# Altium schematic sheet I2C.SchDoc
size A4
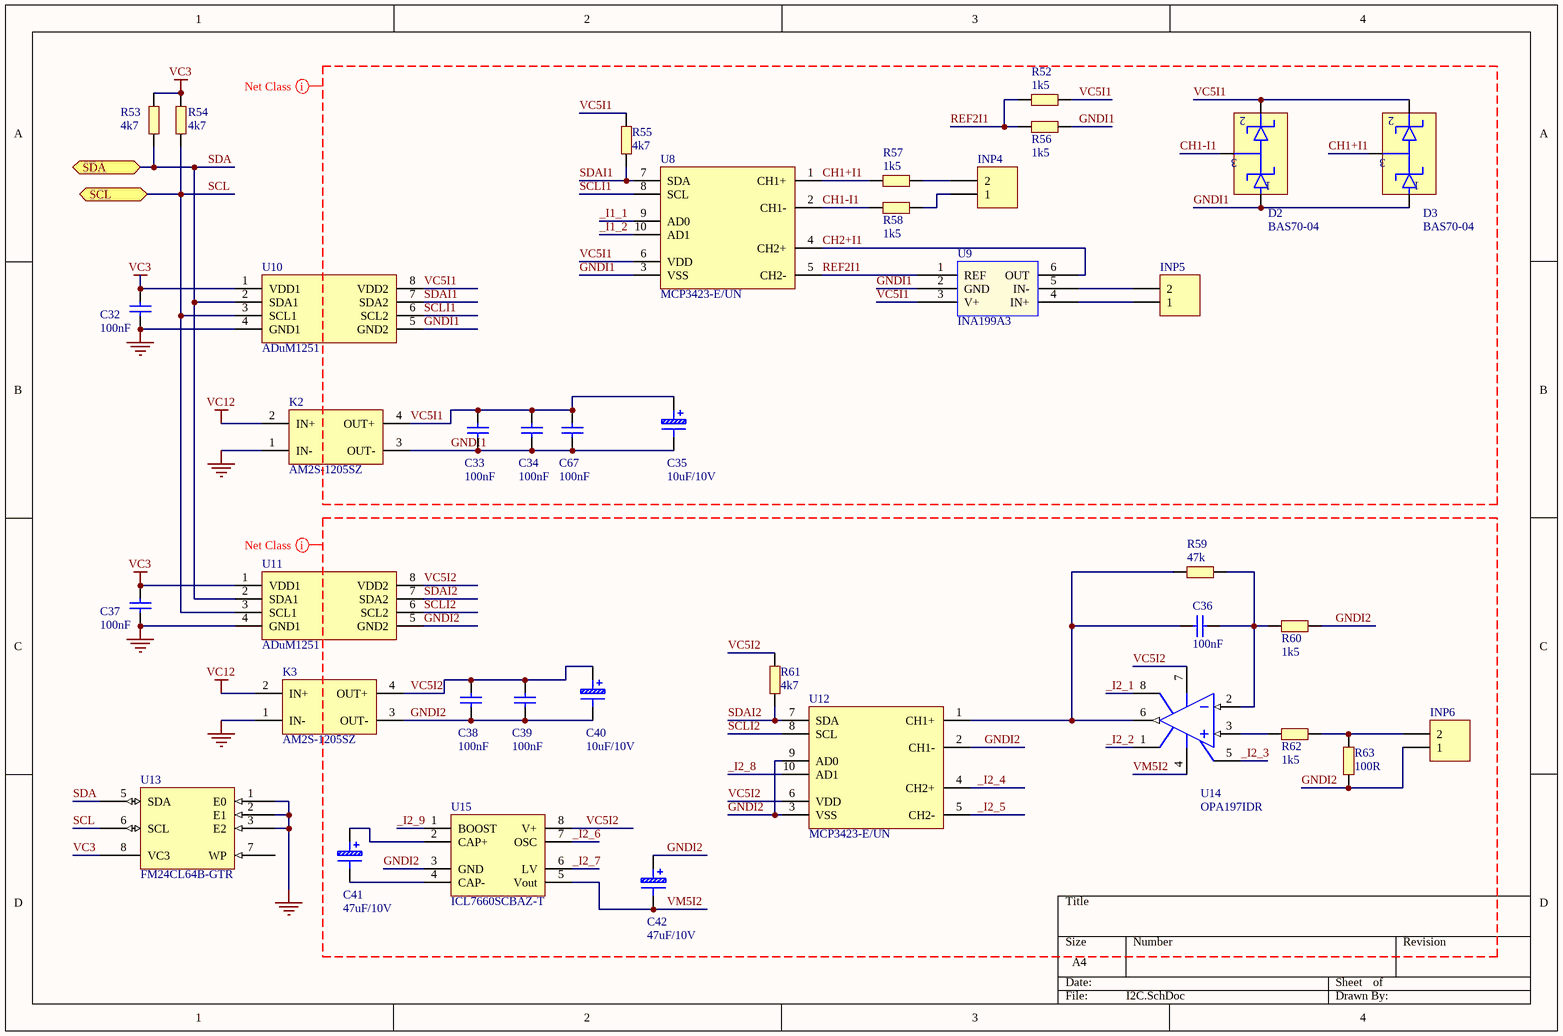
[diagram p0: I2C.SchDoc]

## Parts
C32  100nF  [0603C]
C33  100nF  [0603C]
C34  100nF  [0603C]
C35  10uF/10V  [CAP_A]
C36  100nF  [0603C]
C37  100nF  [0603C]
C38  100nF  [0603C]
C39  100nF  [0603C]
C40  10uF/10V  [CAP_A]
C41  47uF/10V  [CAP_C]
C42  47uF/10V  [CAP_C]
C67  100nF  [0603C]
D2  BAS70-04  [SOT-23]
D3  BAS70-04  [SOT-23]
INP4  Header 2  [JST-XH-2Y-2.54]  (value not drawn)
INP5  Header 2  [JST-XH-2Y-2.54]  (value not drawn)
INP6  Header 2  [JST-XH-2Y-2.54]  (value not drawn)
K2  AM2S-1205SZ  [DCDC_SIL4]
K3  AM2S-1205SZ  [DCDC_SIL4]
R52  1k5  [0603R]
R53  4k7  [0603R]
R54  4k7  [0603R]
R55  4k7  [0603R]
R56  1k5  [0603R]
R57  1k5  [0603R]
R58  1k5  [0603R]
R59  47k  [0603R]
R60  1k5  [0603R]
R61  4k7  [0603R]
R62  1k5  [0603R]
R63  100R  [0603R]
U8  MCP3423-E/UN  [MSOP10_1]
U9  INA199A3  [SC70-6]
U10  ADuM1251  [SO8]
U11  ADuM1251  [SO8]
U12  MCP3423-E/UN  [MSOP10_1]
U13  FM24CL64B-GTR  [SO8]
U14  OPA197IDR  [SO8]
U15  ICL7660SCBAZ-T  [SO8]

## Ports
SCL (bidir), SDA (bidir)

## Nets
GND: C32.1 C37.1 K2.1(IN-) K3.1(IN-) U10.4(GND1) U11.4(GND1) U13.1(E0) U13.2(E1) U13.3(E2) U13.4(GND)
VC3: C32.2 C37.2 R53.1 R54.1 U10.1(VDD1) U11.1(VDD1) U13.8(VC3)
VC12: K2.2(IN+) K3.2(IN+)
_I1_1: U8.9(AD0)
_I1_2: U8.10(AD1)
_I2_1: U14.8(TAB)
_I2_2: U14.1(OS_NUL)
_I2_3: U14.5(OS_NUL)
_I2_4: U12.4(CH2+)
_I2_5: U12.5(CH2-)
_I2_6: U15.7(OSC)
_I2_7: U15.6(LV)
_I2_8: U12.10(AD1)
_I2_9: U15.1(BOOST)
CH1+I1: D3.3 R57.1 U8.1(CH1+)
CH1-I1: D2.3 R58.1 U8.2(CH1-)
CH2+I1: U8.4(CH2+) U9.6(OUT)
GNDI1: C33.1 C34.1 C35.1 C67.1 D2.1 D3.1 K2.3(OUT-) R56.2 U8.3(VSS) U9.2(GND) U10.5(GND2)
GNDI2: C38.1 C39.1 C40.1 C42.2 INP6.1 K3.3(OUT-) R60.2 R63.1 U11.5(GND2) U12.2(CH1-) U12.3(VSS) U12.9(AD0) U15.3(GND)
REF2I1: R52.1 R56.1 U8.5(CH2-) U9.1(REF)
SCL: R54.2 U10.3(SCL1) U11.3(SCL1) U13.6(SCL) ; port SCL
SCLI1: U8.8(SCL) U10.6(SCL2)
SCLI2: U11.6(SCL2) U12.8(SCL)
SDA: R53.2 U10.2(SDA1) U11.2(SDA1) U13.5(SDA) ; port SDA
SDAI1: R55.1 U8.7(SDA) U10.7(SDA2)
SDAI2: R61.1 U11.7(SDA2) U12.7(SDA)
VC5I1: C33.2 C34.2 C35.2 C67.2 D2.2 D3.2 K2.4(OUT+) R52.2 R55.2 U8.6(VDD) U9.3(V+) U10.8(VDD2)
VC5I2: C38.2 C39.2 C40.2 K3.4(OUT+) R61.2 U11.8(VDD2) U12.6(VDD) U14.7(V+) U15.8(V+)
VM5I2: C42.1 U14.4(V-) U15.5(Vout)
NetC36_1: C36.1 R59.2 R60.1 U14.2(IN-)
NetC36_2: C36.2 R59.1 U12.1(CH1+) U14.6(OUT)
NetC41_1: C41.1 U15.4(CAP-)
NetC41_2: C41.2 U15.2(CAP+)
NetINP4_1: INP4.1 R58.2
NetINP4_2: INP4.2 R57.2
NetINP5_1: INP5.1 U9.4(IN+)
NetINP5_2: INP5.2 U9.5(IN-)
NetINP6_2: INP6.2 R62.2 R63.2
NetR62_1: R62.1 U14.3(IN+)

Not connected (* = marked no-connect by the designer): U13 7(WP)

## Layout directives
net class Izol_1: _I1_1, _I1_2, CH1+I1, CH1-I1, CH2+I1, GNDI1, REF2I1, SCLI1, SDAI1, VC5I1
net class Izol_2: _I2_1, _I2_2, _I2_3, _I2_4, _I2_5, _I2_6, _I2_7, _I2_8, _I2_9, GNDI2, SCLI2, SDAI2, VC5I2, VM5I2

## Library data of the parts
C32-C34 C36-C39 C67 = Cap_100nF_X7R_10%_0402: Capacitor,100nF,16V,X7R,10%,0402,YAGEO; Manuf_Part_1: CC0402KRX7R7BB104; Revision: July-2002: Re-released for DXP Platform.; Value: 100nF; Order: CC0402KRX7R7BB104; Manuf_1: YAGEO
C35 C40-C42 = CapTantal
INP4-INP6 = Header 2: Header, 2-Pin; LatestRevisionDate: 17-Jul-2002; LatestRevisionNote: Re-released for DXP Platform.; Publisher: Altium Limited
K2 K3 = DCDC_SIL
R52-R63 = RES3
U8 U12 = MCP3423
U9 = INA199: Dostawca.Symbol: INA199A3DCKT; Dostawca: TME
U10 U11 = ADuM1251: ADuM1251ARZ
U13 = AT24C02
U14 = Op Amp: FET Operational Amplifier; Published: 8-Jun-2000; LatestRevisionDate: 17-Jul-2002; LatestRevisionNote: Re-released for DXP Platform.; DatasheetVersion: REV. B; PackageVersion: 1990; PackageReference: H-08A; Publisher: Altium Limited; PackageDescription: Can; 8 Leads; Pin Circle Dia. 5.08 mm; Lead Dia. 0.53 mm (max); ComponentLink1Description: Manufacturer Link; ComponentLink1URL: http://www.analog.com/
U15 = ICL7660